# Altium schematic sheet mcu.SchDoc
size A4; SheetNumber: 2; SheetTotal: 8
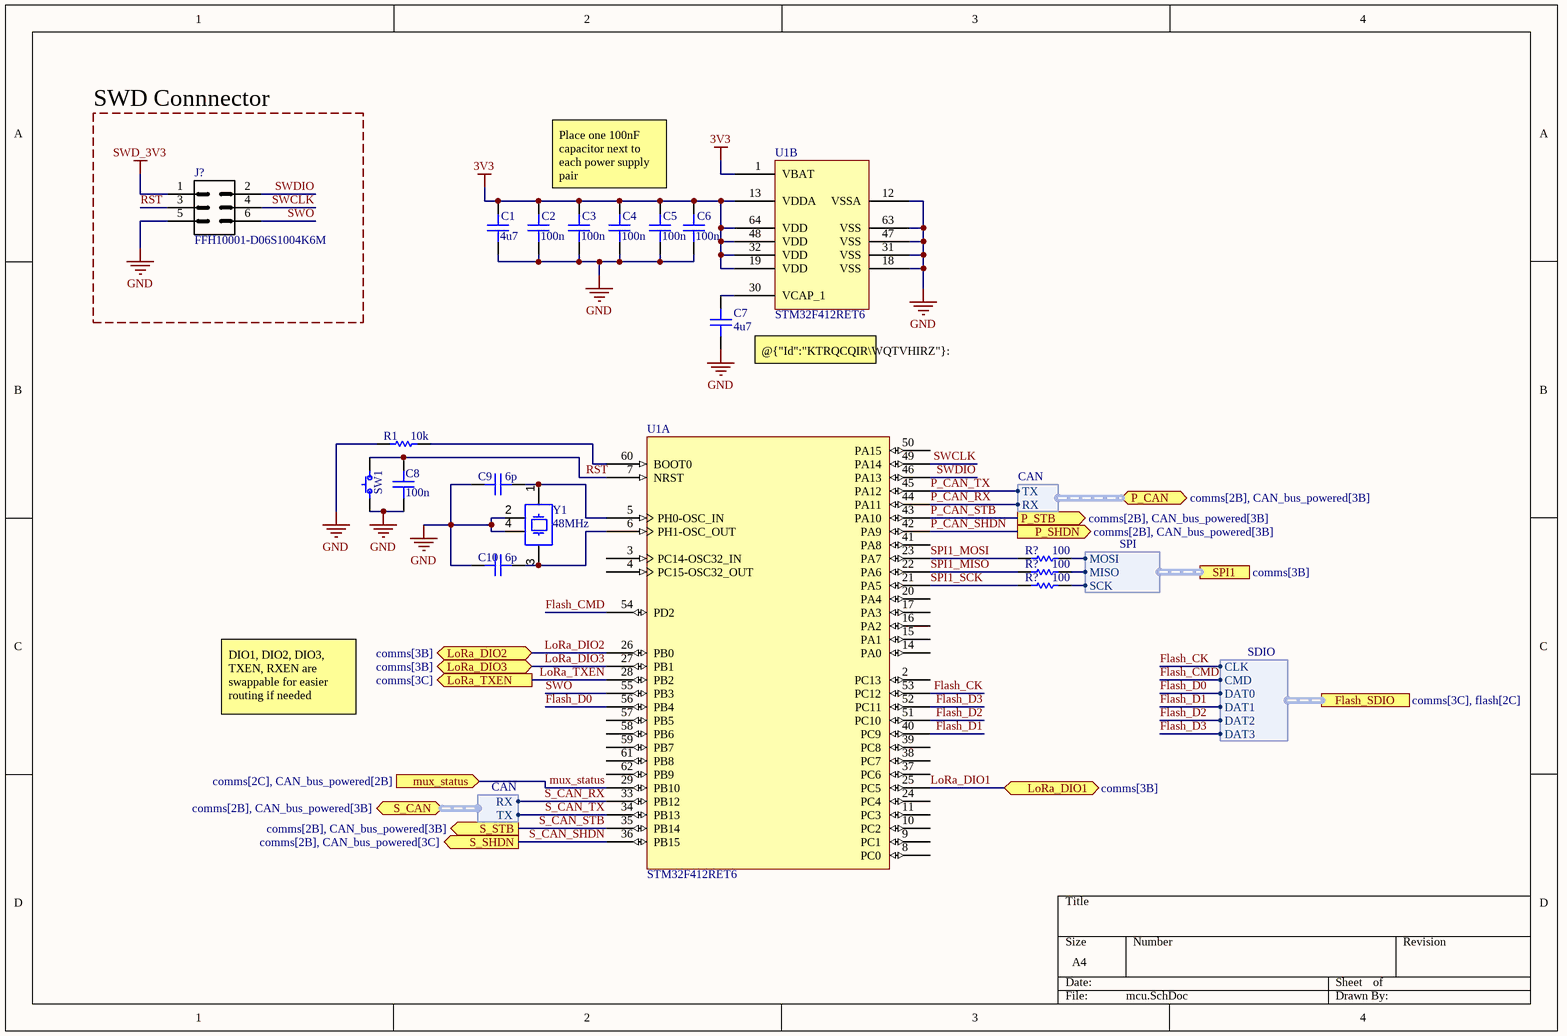
[diagram p0: mcu.SchDoc]

## Parts
(Parts that share a designator on the sheet are numbered #1, #2 ... from top to bottom, then left to right.)
C1  4u7
C2  100n
C3  100n
C4  100n
C5  100n
C6  100n
C7  4u7
C8  100n
C9  6p
C10  6p
J?  FFH10001-D06S1004K6M
R1  10k
R?#1  100
R?#2  100
R?#3  100
SW1  SPST Switch  (value not drawn)
U1  STM32F412RET6  (parts A,B of 2)
Y1  48MHz

## Blocks framed on the sheet
SWD Connnector: J?

## Ports
Flash_SDIO (harness SDIO, see comms[3C], flash[2C]), LoRa_DIO1 (bidir, see comms[3B]), LoRa_DIO2 (bidir, see comms[3B]), LoRa_DIO3 (bidir, see comms[3B]), LoRa_TXEN (out, see comms[3C]), mux_status (in, see comms[2C], CAN_bus_powered[2B]), P_CAN (bidir, harness CAN, see comms[2B], CAN_bus_powered[3B]), P_SHDN (out, see comms[2B], CAN_bus_powered[3B]), P_STB (out, see comms[2B], CAN_bus_powered[3B]), S_CAN (bidir, harness CAN, see comms[2B], CAN_bus_powered[3B]), S_SHDN (out, see comms[2B], CAN_bus_powered[3C]), S_STB (out, see comms[2B], CAN_bus_powered[3B]), SPI1 (harness SPI, see comms[3B])

## Harnesses
SDIO: CLK, CMD, DAT0, DAT1, DAT2, DAT3
CAN: TX, RX
SPI: MISO, SCK, MOSI

## Nets
3V3: C1.2 C2.2 C3.2 C4.2 C5.2 C6.2 U1.1(VBAT) U1.13(VDDA) U1.19(VDD) U1.32(VDD) U1.48(VDD) U1.64(VDD)
GND: C1.1 C2.1 C3.1 C4.1 C5.1 C6.1 C7.1 C8.1 C9.1 C10.1 J?.5 R1.1 SW1.1 U1.12(VSSA) U1.18(VSS) U1.31(VSS) U1.47(VSS) U1.63(VSS) Y1.2(GND) Y1.4(GND)
SWD_3V3: J?.1
Flash_CK: U1.53(PC12) ; port Flash_SDIO.CLK
Flash_CMD: U1.54(PD2) ; port Flash_SDIO.CMD
Flash_D0: U1.56(PB4) ; port Flash_SDIO.DAT0
Flash_D1: U1.40(PC9) ; port Flash_SDIO.DAT1
Flash_D2: U1.51(PC10) ; port Flash_SDIO.DAT2
Flash_D3: U1.52(PC11) ; port Flash_SDIO.DAT3
LoRa_DIO1: U1.25(PC5) ; port LoRa_DIO1
LoRa_DIO2: U1.26(PB0) ; port LoRa_DIO2
LoRa_DIO3: U1.27(PB1) ; port LoRa_DIO3
LoRa_TXEN: U1.28(PB2) ; port LoRa_TXEN
mux_status: U1.29(PB10) ; port mux_status
P_CAN_RX: U1.44(PA11) ; port P_CAN.RX
P_CAN_SHDN: U1.42(PA9) ; port P_SHDN
P_CAN_STB: U1.43(PA10) ; port P_STB
P_CAN_TX: U1.45(PA12) ; port P_CAN.TX
RST: C8.2 J?.3 SW1.2 U1.7(NRST)
S_CAN_RX: U1.33(PB12) ; port S_CAN.RX
S_CAN_SHDN: U1.36(PB15) ; port S_SHDN
S_CAN_STB: U1.35(PB14) ; port S_STB
S_CAN_TX: U1.34(PB13) ; port S_CAN.TX
SPI1_MISO: R?#2.2 U1.22(PA6)
SPI1_MOSI: R?#1.2 U1.23(PA7)
SPI1_SCK: R?#3.2 U1.21(PA5)
SWCLK: J?.4 U1.49(PA14)
SWDIO: J?.2 U1.46(PA13)
SWO: J?.6 U1.55(PB3)
NetC7_2: C7.2 U1.30(VCAP_1)
NetC9_2: C9.2 U1.5(PH0-OSC_IN) Y1.1(X1)
NetC10_2: C10.2 U1.6(PH1-OSC_OUT) Y1.3(X2)
NetR1_2: R1.2 U1.60(BOOT0)
NetR?#1_1: R?#1.1 ; port SPI1.MOSI
NetR?#2_1: R?#2.1 ; port SPI1.MISO
NetR?#3_1: R?#3.1 ; port SPI1.SCK

Not connected (* = marked no-connect by the designer): U1 2(PC13) 3(PC14-OSC32_IN) 4(PC15-OSC32_OUT) 8(PC0) 9(PC1) 10(PC2) 11(PC3) 14(PA0) 15(PA1) 16(PA2) 17(PA3) 20(PA4) 24(PC4) 37(PC6) 38(PC7) 39(PC8) 41(PA8) 50(PA15) 57(PB5) 58(PB6) 59(PB7) 61(PB8) 62(PB9)

## Notes on the sheet
- Place one 100nF capacitor next to each power supply pair
- @{"Id":"KTRQCQIR\WQTVHIRZ"}: ESR < 1 Ohm
- DIO1, DIO2, DIO3, TXEN, RXEN are swappable for easier routing if needed

## Library data of the parts
C1-C10 = Capacitor
J? = Connector 6-Pin 2 Row
R1 R?#1-R?#3 = Resistor
SW1 = SW_SPST
U1 = STM32F412RET6: 512KB 1.7V~3.6V ARM Cortex-M4 256KB 100MHz FLASH 50 LQFP-64(10x10) Microcontroller Units (MCUs/MPUs/SOCs) ROHS
Y1 = XTAL-4Pin: HCI XC32M4-48.000-F08NLDT / 8pF load capacitance